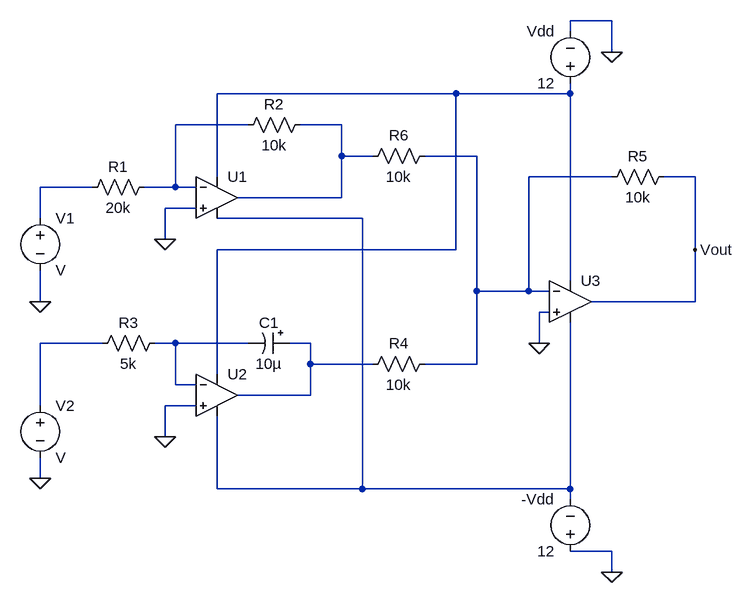
[diagram p0: schematic expt8_Question_2.asc]
expt8_Question_2.asc, the LTspice schematic file:
Version 4
SHEET 1 988 760
WIRE 816 -128 752 -128
WIRE 752 -112 752 -128
WIRE 816 -80 816 -128
WIRE 576 -16 208 -16
WIRE 752 -16 752 -32
WIRE 752 -16 576 -16
WIRE 256 32 144 32
WIRE 400 32 336 32
WIRE 400 80 400 32
WIRE 448 80 400 80
WIRE 608 80 528 80
WIRE 208 112 208 -16
WIRE 816 112 688 112
WIRE 944 112 896 112
WIRE 16 128 -64 128
WIRE 144 128 144 32
WIRE 144 128 96 128
WIRE 176 128 144 128
WIRE 400 144 400 80
WIRE 400 144 240 144
WIRE 176 160 128 160
WIRE -64 176 -64 128
WIRE 432 176 208 176
WIRE 128 208 128 160
WIRE 576 224 576 -16
WIRE 576 224 208 224
WIRE 944 224 944 112
WIRE 752 272 752 -16
WIRE 608 288 608 80
WIRE 688 288 688 112
WIRE 688 288 608 288
WIRE 720 288 688 288
WIRE -64 304 -64 256
WIRE 944 304 944 224
WIRE 944 304 784 304
WIRE 720 320 704 320
WIRE 32 368 -64 368
WIRE 144 368 112 368
WIRE 256 368 144 368
WIRE 352 368 320 368
WIRE 704 368 704 320
WIRE 352 400 352 368
WIRE 448 400 352 400
WIRE 608 400 608 288
WIRE 608 400 528 400
WIRE 208 416 208 224
WIRE 144 432 144 368
WIRE 176 432 144 432
WIRE 352 448 352 400
WIRE 352 448 240 448
WIRE -64 464 -64 368
WIRE 176 464 128 464
WIRE 128 512 128 464
WIRE -64 576 -64 544
WIRE 208 592 208 480
WIRE 432 592 432 176
WIRE 432 592 208 592
WIRE 752 592 752 336
WIRE 752 592 432 592
WIRE 752 608 752 592
WIRE 816 688 752 688
WIRE 816 720 816 688
FLAG 816 720 0
FLAG 816 -80 0
FLAG -64 576 0
FLAG -64 304 0
FLAG 704 368 0
FLAG 128 512 0
FLAG 128 208 0
FLAG 944 224 Vout
SYMBOL OpAmps\\UniversalOpAmp 208 144 R0
SYMATTR InstName U1
SYMBOL OpAmps\\UniversalOpAmp 208 448 R0
SYMATTR InstName U2
SYMBOL OpAmps\\UniversalOpAmp 752 304 R0
SYMATTR InstName U3
SYMBOL voltage -64 160 R0
SYMATTR InstName V1
SYMBOL voltage -64 448 R0
WINDOW 123 0 0 Left 0
WINDOW 39 0 0 Left 0
SYMATTR InstName V2
SYMBOL voltage 752 704 R180
WINDOW 0 24 96 Left 2
WINDOW 3 24 16 Left 2
WINDOW 123 0 0 Left 0
WINDOW 39 0 0 Left 0
SYMATTR InstName -Vdd
SYMATTR Value 12
SYMBOL voltage 752 -16 R180
WINDOW 0 24 96 Left 2
WINDOW 3 24 16 Left 2
SYMATTR InstName Vdd
SYMATTR Value 12
SYMBOL res 112 112 R90
WINDOW 0 0 56 VBottom 2
WINDOW 3 32 56 VTop 2
SYMATTR InstName R1
SYMATTR Value 20k
SYMBOL res 352 16 R90
WINDOW 0 0 56 VBottom 2
WINDOW 3 32 56 VTop 2
SYMATTR InstName R2
SYMATTR Value 10k
SYMBOL res 128 352 R90
WINDOW 0 0 56 VBottom 2
WINDOW 3 32 56 VTop 2
SYMATTR InstName R3
SYMATTR Value 5k
SYMBOL res 544 384 R90
WINDOW 0 0 56 VBottom 2
WINDOW 3 32 56 VTop 2
SYMATTR InstName R4
SYMATTR Value 10k
SYMBOL res 912 96 R90
WINDOW 0 0 56 VBottom 2
WINDOW 3 32 56 VTop 2
SYMATTR InstName R5
SYMATTR Value 10k
SYMBOL polcap 320 352 R90
WINDOW 0 0 32 VBottom 2
WINDOW 3 32 32 VTop 2
SYMATTR InstName C1
SYMATTR Value 10µ
SYMATTR Description Capacitor
SYMATTR Type cap
SYMATTR SpiceLine V=6.3 Irms=0 Rser=4 Lser=0 mfg="AVX" pn="TAJA106M006" type="Tantalum"
SYMBOL res 544 64 R90
WINDOW 0 0 56 VBottom 2
WINDOW 3 32 56 VTop 2
SYMATTR InstName R6
SYMATTR Value 10k

The netlist it stands for:
* expt8_Question_2.asc
XU1 0 N002 N001 N006 N003 level1 Avol=1Meg GBW=10Meg Vos=0 En=0 Enk=0 In=0 Ink=0 Rin=500Meg  ; pins In+ In- V+ V- OUT
XU2 0 N008 N001 N006 N009 level1 Avol=1Meg GBW=10Meg Vos=0 En=0 Enk=0 In=0 Ink=0 Rin=500Meg  ; pins In+ In- V+ V- OUT
XU3 0 N004 N001 N006 Vout level1 Avol=1Meg GBW=10Meg Vos=0 En=0 Enk=0 In=0 Ink=0 Rin=500Meg  ; pins In+ In- V+ V- OUT
V1 N005 0 V
V2 N007 0 V
V§-Vdd 0 N006 12
Vdd N001 0 12
R1 N002 N005 20k
R2 N003 N002 10k
R3 N008 N007 5k
R4 N004 N009 10k
R5 Vout N004 10k
C1 N009 N008 10µ V=6.3 Irms=0 Rser=4 Lser=0 mfg="AVX" pn="TAJA106M006" type="Tantalum"
R6 N004 N003 10k
.lib UniversalOpAmp1.lib
.backanno
.end